# EAGLE schematic Gateway_Mega_Shield_v0.1 (EAGLE 9.4.2)
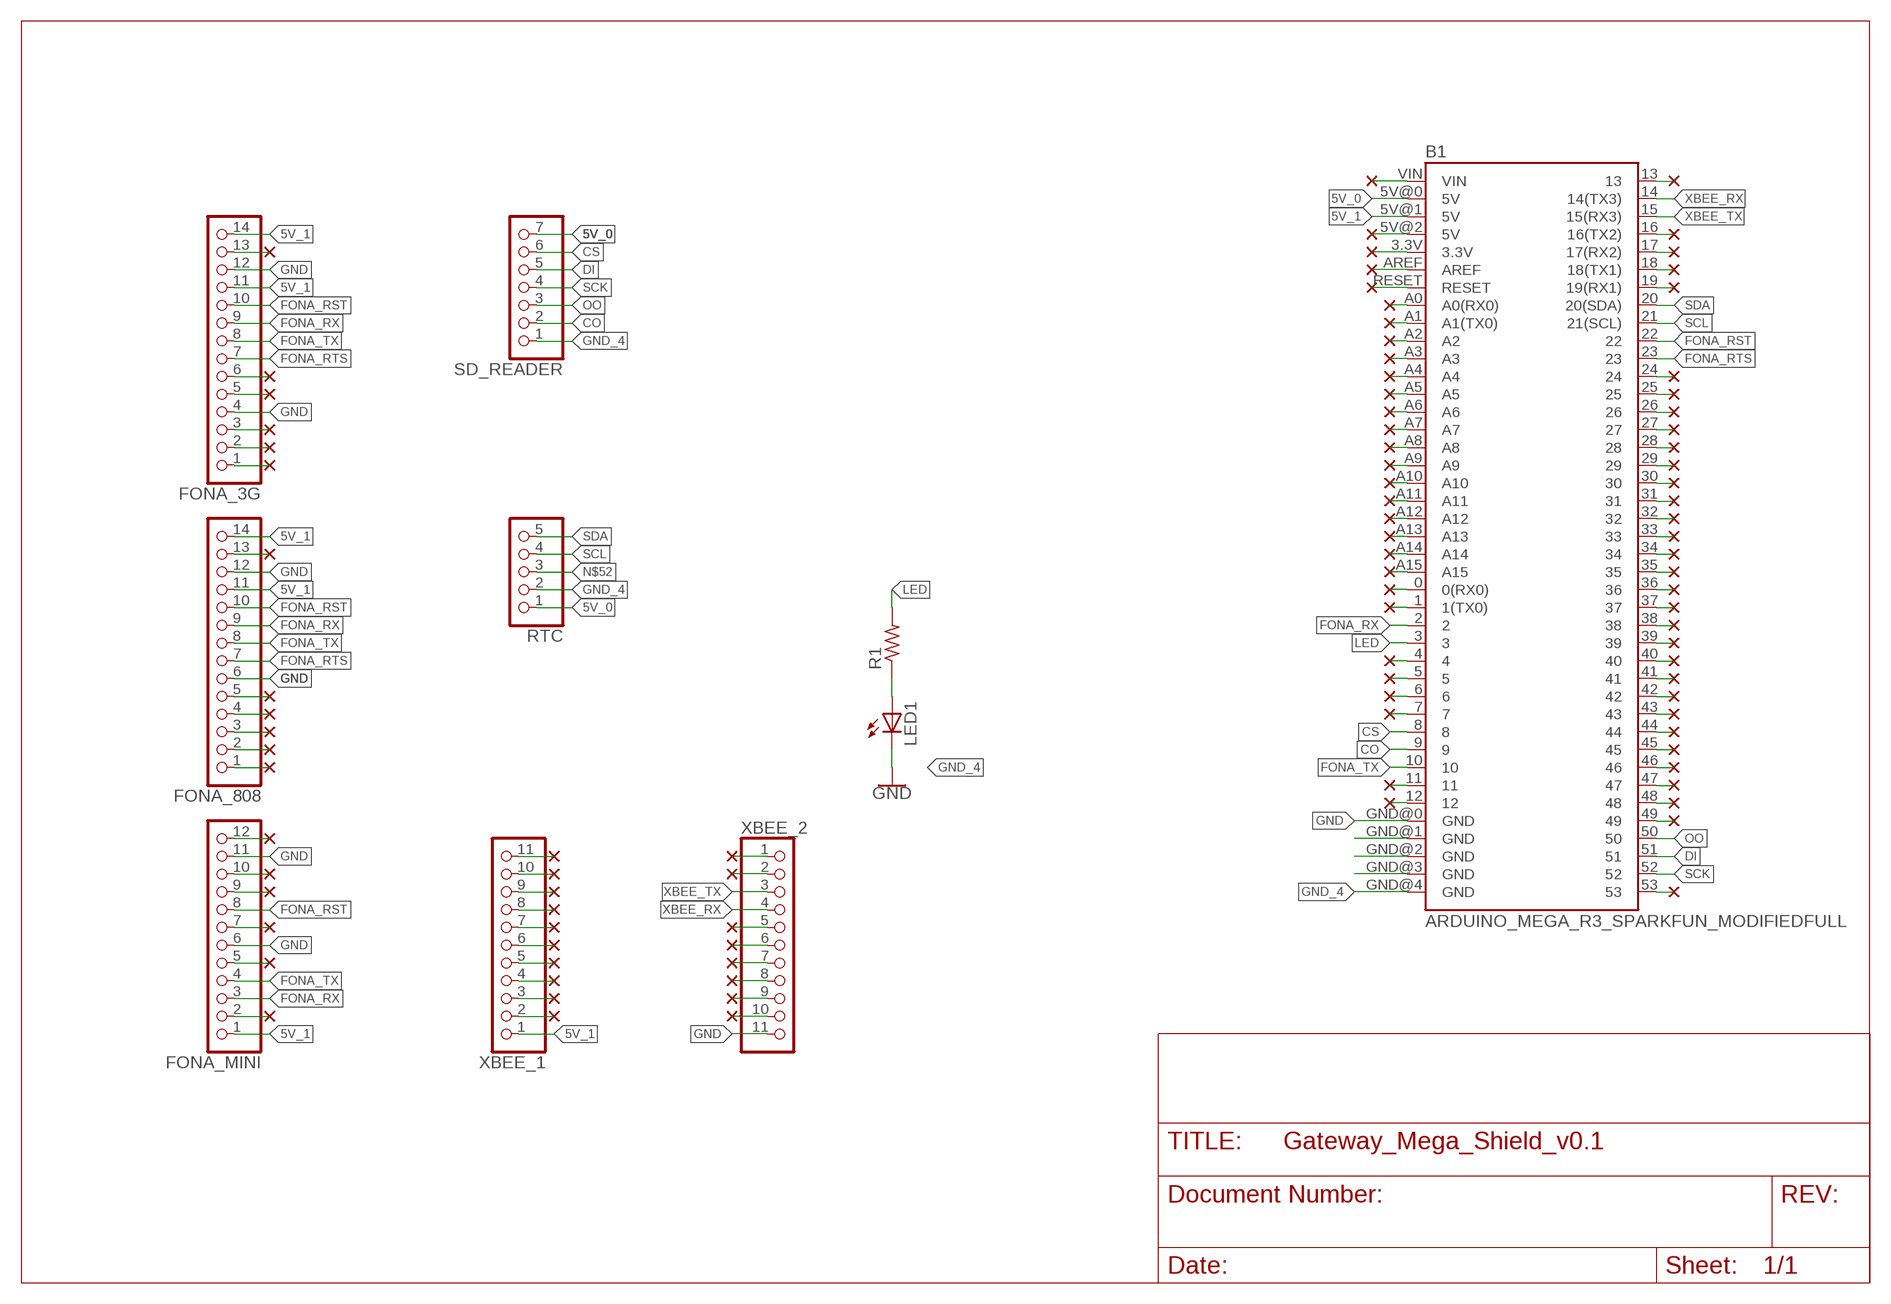
[diagram p0: schematic, sheet 1]

## Parts
B1  ARDUINO_MEGA_R3_SPARKFUN_MODIFIEDFULL  [ARDUINO_MEGA_SPARKFUN_MODIFIED]
FONA_3G  PINHD-1X14  [1X14]
FONA_808  PINHD-1X14  [1X14]
FONA_MINI  PINHD-1X12  [1X12]
LED1  LED5MM  [LED5MM]
R1  R-US_0207/10  [0207/10]
RTC  PINHD-1X5  [1X05]
SD_READER  PINHD-1X7  [1X07]
XBEE_1  PINHD-1X11  [1X11]
XBEE_2  PINHD-1X11  [1X11]

## Nets
5V_0: B1.5V@0(5V) RTC.1 SD_READER.7
5V_1: B1.5V@1(5V) FONA_3G.11 FONA_3G.14 FONA_808.11 FONA_808.14 FONA_MINI.1 XBEE_1.1
CO: B1.9 SD_READER.2
CS: B1.8 SD_READER.6
DI: B1.51 SD_READER.5
FONA_RST: B1.22 FONA_3G.10 FONA_808.10 FONA_MINI.8
FONA_RTS: B1.23 FONA_3G.7 FONA_808.7
FONA_RX: B1.2 FONA_3G.9 FONA_808.9 FONA_MINI.3
FONA_TX: B1.10 FONA_3G.8 FONA_808.8 FONA_MINI.4
GND: B1.GND@0(GND) FONA_3G.4 FONA_3G.12 FONA_808.6 FONA_808.12 FONA_MINI.6 FONA_MINI.11 XBEE_2.11
GND_4: B1.GND@4(GND) LED1.K(C) RTC.2 SD_READER.1 ; supply symbol labelled GND
LED: B1.3 R1.2
N$1: LED1.A R1.1
N$2: B1.13
N$3: B1.GND@2(GND)
N$4: FONA_3G.13
N$5: B1.GND@3(GND)
N$6: B1.5V@2(5V)
N$7: XBEE_2.1
N$8: B1.GND@1(GND)
N$11: FONA_3G.6
N$12: FONA_3G.5
N$14: FONA_3G.3
N$15: FONA_3G.2
N$16: FONA_3G.1
N$18: FONA_808.13
N$26: FONA_808.5
N$27: FONA_808.4
N$28: FONA_808.3
N$29: FONA_808.2
N$30: FONA_808.1
N$31: FONA_MINI.12
N$33: FONA_MINI.10
N$34: FONA_MINI.9
N$36: FONA_MINI.7
N$38: FONA_MINI.5
N$41: FONA_MINI.2
N$52: RTC.3
N$57: B1.16(16(TX2))
N$58: B1.17(17(RX2))
N$59: B1.18(18(TX1))
N$60: B1.19(19(RX1))
N$65: B1.24
N$66: B1.25
N$67: B1.26
N$68: B1.27
N$69: B1.28
N$70: B1.29
N$71: B1.30
N$72: B1.31
N$73: B1.32
N$74: B1.33
N$75: B1.34
N$76: B1.35
N$77: B1.36
N$78: B1.37
N$79: B1.38
N$80: B1.39
N$81: B1.40
N$82: B1.41
N$83: B1.42
N$84: B1.43
N$85: B1.44
N$86: B1.45
N$87: B1.46
N$88: B1.47
N$89: B1.48
N$90: B1.49
N$94: B1.53
N$100: B1.12
N$101: B1.11
N$105: B1.7
N$106: B1.6
N$107: B1.5
N$108: B1.4
N$109: XBEE_1.11
N$111: B1.1(1(TX0))
N$112: B1.0(0(RX0))
N$113: B1.A15
N$114: B1.A14
N$115: B1.A13
N$116: B1.A12
N$117: B1.A11
N$118: B1.A10
N$119: B1.VIN
N$123: B1.3.3V
N$124: B1.AREF
N$125: B1.RESET
N$126: B1.A0(A0(RX0))
N$127: B1.A1(A1(TX0))
N$128: B1.A2
N$129: B1.A3
N$130: B1.A4
N$131: B1.A9
N$132: B1.A8
N$133: B1.A7
N$134: B1.A6
N$135: B1.A5
N$136: XBEE_1.10
N$137: XBEE_1.9
N$138: XBEE_1.8
N$139: XBEE_1.7
N$140: XBEE_1.6
N$141: XBEE_1.5
N$142: XBEE_1.4
N$143: XBEE_1.3
N$144: XBEE_1.2
N$147: XBEE_2.2
N$150: XBEE_2.5
N$151: XBEE_2.6
N$152: XBEE_2.7
N$153: XBEE_2.8
N$154: XBEE_2.9
N$155: XBEE_2.10
OO: B1.50 SD_READER.3
SCK: B1.52 SD_READER.4
SCL: B1.21(21(SCL)) RTC.4
SDA: B1.20(20(SDA)) RTC.5
XBEE_RX: B1.14(14(TX3)) XBEE_2.4
XBEE_TX: B1.15(15(RX3)) XBEE_2.3

## Library data of the parts
B1 = wsn_x:ARDUINO_MEGA_R3_SPARKFUN_MODIFIED: Arduino Mega R3 ATmega2560 R3 compatible footprint. SparkFun Products: Arduino Mega 2560 R3 <https://www.sparkfun.com/products/11061>
FONA_3G FONA_808 = pinhead:PINHD-1X14: PIN HEADER
FONA_MINI = pinhead:PINHD-1X12: PIN HEADER
LED1 = adafruit:LED: LED OSRAM: - CHIPLED LG R971, LG N971, LY N971, LG Q971, LY Q971, LO R971, LY R971 LH N974, LH R974 LS Q976, LO Q976, LY Q976 LO Q996 - Hyper CHIPLED LW Q18S LB Q993, LB Q99A, LB R99A - SideLED LS A670, LO A670, LY A670, LG A670, LP A670 LB A673, LV A673, LT A673, LW A673 LH A674 LY A675 LS A676, LA A676, LO A676, LY A676, LW A676 LS A679, LY A679, LG A679 - Hyper Micro SIDELED® LS Y876, LA Y876, LO Y876, LY Y876 LT Y87S - SmartLED LW L88C, LW L88S LB L89C, LB L89S, LG L890 LS L89K, LO L89K, LY L89K LS L896, LA L896, LO L896, LY L896 - TOPLED LS T670, LO T670, LY T670, LG T670, LP T670 LSG T670, LSP T670, LSY T670, LOP T670, LYG T670 LG T671, LOG T671, LSG T671 LB T673, LV T673, LT T673, LW T673 LH T674 LS T676, LA T676, LO T676, LY T676, LB T676, LH T676, LSB T676, LW T676 LB T67C, LV T67C, LT T67C, LS T67K, LO T67K, LY T67K, LW E67C LS E67B, LA E67B, LO E67B, LY E67B, LB E67C, LV E67C, LT E67C LW T67C LS T679, LY T679, LG T679 LS T770, LO T770, LY T770, LG T770, LP T770 LB T773, LV T773, LT T773, LW T773 LH T774 LS E675, LA E675, LY E675, LS T675 LS T776, LA T776, LO T776, LY T776, LB T776 LHGB T686 LT T68C, LB T68C - Hyper Mini TOPLED® LB M676 - Mini TOPLED Santana® LG M470 LS M47K, LO M47K, LY M47K Source: http://www.osram.convergy.de/
R1 = adafruit:R-US_: RESISTOR, American symbol
RTC = pinhead:PINHD-1X5: PIN HEADER
SD_READER = pinhead:PINHD-1X7: PIN HEADER
XBEE_1 XBEE_2 = pinhead:PINHD-1X11: PIN HEADER